# Altium project ALCT_MEZ_LX100.PrjPcb (part 8 of 8)

## Sheet Promless_Power.SchDoc: PROMless Power
size A; Organization: UCLA High Energy Physics; DocumentNumber: 18; Revision: 2.0; SheetNumber: 18; SheetTotal: 23; CurrentDate: 9/6/2018; ModifiedDate: 9/6/2018
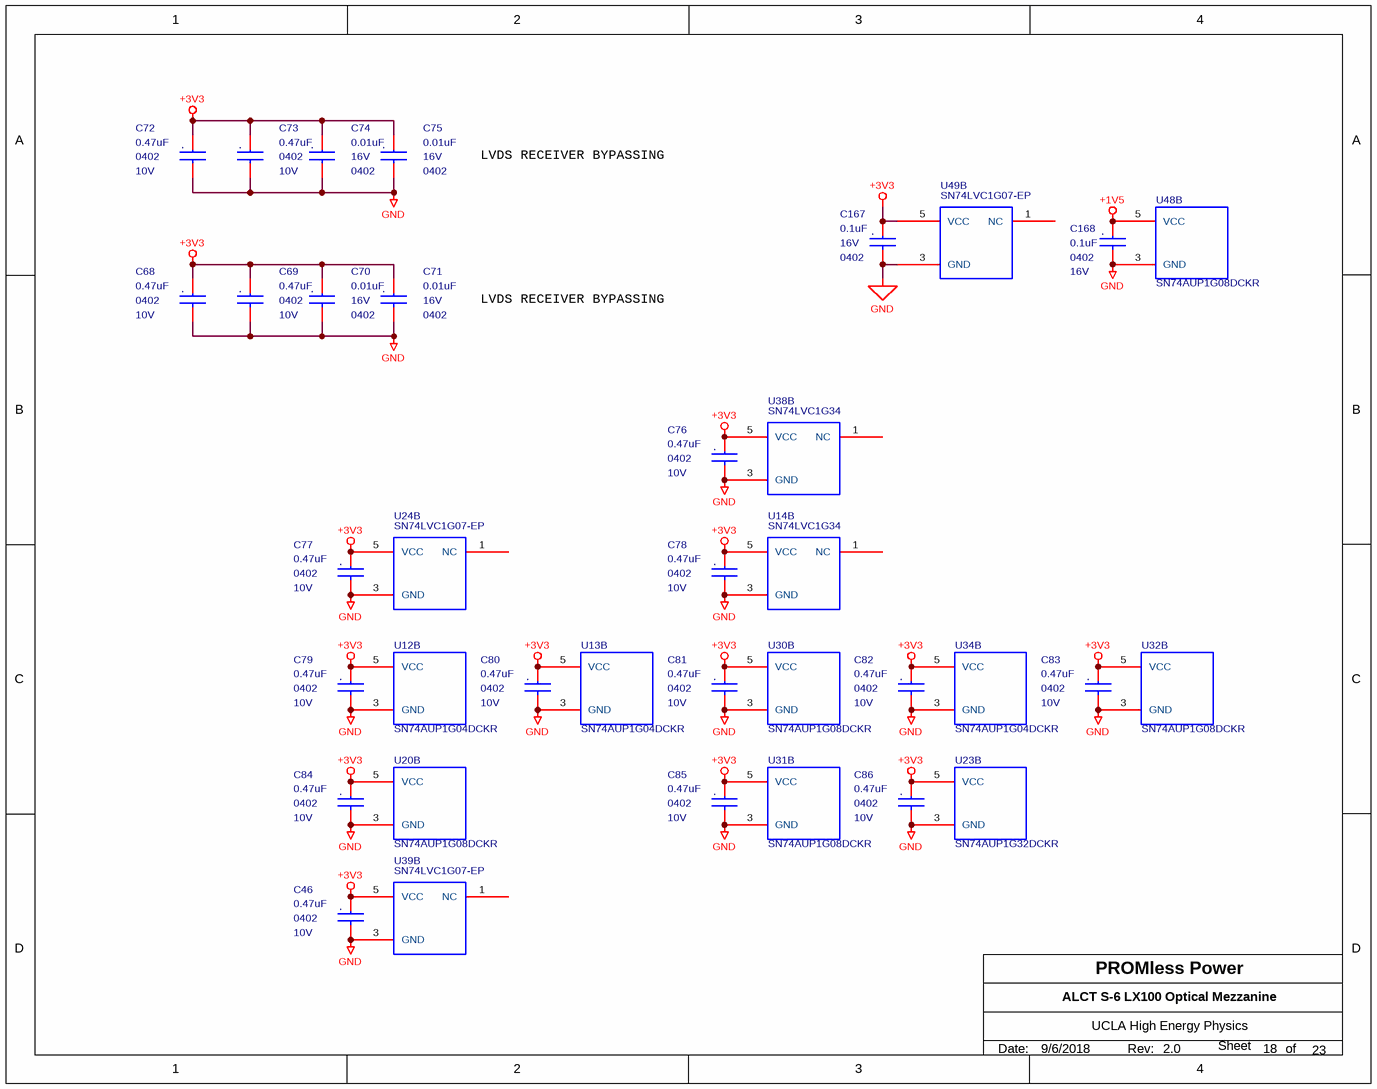
[diagram p25: Promless_Power.SchDoc]

### Parts
C46  0.47uF  Voltage - Rated: 10V  package: 0402  [MC_S6/SM/C_0402_IPC]
C68  0.47uF  Voltage - Rated: 10V  package: 0402  [MC_S6/SM/C_0402_IPC]
C69  0.47uF  Voltage - Rated: 10V  package: 0402  [MC_S6/SM/C_0402_IPC]
C70  0.01uF  Voltage - Rated: 16V  package: 0402  [MC_S6/SM/C_0402_IPC]
C71  0.01uF  Voltage - Rated: 16V  package: 0402  [MC_S6/SM/C_0402_IPC]
C72  0.47uF  Voltage - Rated: 10V  package: 0402  [MC_S6/SM/C_0402_IPC]
C73  0.47uF  Voltage - Rated: 10V  package: 0402  [MC_S6/SM/C_0402_IPC]
C74  0.01uF  Voltage - Rated: 16V  package: 0402  [MC_S6/SM/C_0402_IPC]
C75  0.01uF  Voltage - Rated: 16V  package: 0402  [MC_S6/SM/C_0402_IPC]
C76  0.47uF  Voltage - Rated: 10V  package: 0402  [MC_S6/SM/C_0402_IPC]
C77  0.47uF  Voltage - Rated: 10V  package: 0402  [MC_S6/SM/C_0402_IPC]
C78  0.47uF  Voltage - Rated: 10V  package: 0402  [MC_S6/SM/C_0402_IPC]
C79  0.47uF  Voltage - Rated: 10V  package: 0402  [MC_S6/SM/C_0402_IPC]
C80  0.47uF  Voltage - Rated: 10V  package: 0402  [MC_S6/SM/C_0402_IPC]
C81  0.47uF  Voltage - Rated: 10V  package: 0402  [MC_S6/SM/C_0402_IPC]
C82  0.47uF  Voltage - Rated: 10V  package: 0402  [MC_S6/SM/C_0402_IPC]
C83  0.47uF  Voltage - Rated: 10V  package: 0402  [MC_S6/SM/C_0402_IPC]
C84  0.47uF  Voltage - Rated: 10V  package: 0402  [MC_S6/SM/C_0402_IPC]
C85  0.47uF  Voltage - Rated: 10V  package: 0402  [MC_S6/SM/C_0402_IPC]
C86  0.47uF  Voltage - Rated: 10V  package: 0402  [MC_S6/SM/C_0402_IPC]
C167  0.1uF  package: 0402  Voltage - Rated: 16V  [MC_S6/SM/C_0402_IPC]
C168  0.1uF  package: 0402  Voltage - Rated: 16V  [MC_S6/SM/C_0402_IPC]
U12  SN74AUP1G04DCKR  [MC_S6/SM/SOT_SC70_DCK5]  (part B of 2)
U13  SN74AUP1G04DCKR  [MC_S6/SM/SOT_SC70_DCK5]  (part B of 2)
U14  SN74LVC1G34  [MC_S6/SM/SOT_553_DRL5]  (part B of 2)
U20  SN74AUP1G08DCKR  [MC_S6/SM/SOT_SC70_DCK5]  (part B of 2)
U23  SN74AUP1G32DCKR  [MC_S6/SM/SOT_SC70_DCK5]  (part B of 2)
U24  SN74LVC1G07-EP  [SOT353-1]  (part B of 2)
U30  SN74AUP1G08DCKR  [MC_S6/SM/SOT_SC70_DCK5]  (part B of 2)
U31  SN74AUP1G08DCKR  [MC_S6/SM/SOT_SC70_DCK5]  (part B of 2)
U32  SN74AUP1G08DCKR  [MC_S6/SM/SOT_SC70_DCK5]  (part B of 2)
U34  SN74AUP1G04DCKR  [MC_S6/SM/SOT_SC70_DCK5]  (part B of 2)
U38  SN74LVC1G34  [MC_S6/SM/SOT_553_DRL5]  (part B of 2)
U39  SN74LVC1G07-EP  [SOT353-1]  (part B of 2)
U48  SN74AUP1G08DCKR  [MC_S6/SM/SOT_SC70_DCK5]  (part B of 2)
U49  SN74LVC1G07-EP  [SOT353-1]  (part B of 2)

### Nets
+1V5: C168.1 U48.5(VCC)
+3V3: C46.1 C68.1 C69.1 C70.1 C71.1 C72.1 C73.1 C74.1 C75.1 C76.1 C77.1 C78.1 C79.1 C80.1 C81.1 C82.1 C83.1 C84.1 C85.1 C86.1 C167.1 U12.5(VCC) U13.5(VCC) U14.5(VCC) U20.5(VCC) U23.5(VCC) U24.5(VCC) U30.5(VCC) U31.5(VCC) U32.5(VCC) U34.5(VCC) U38.5(VCC) U39.5(VCC) U49.5(VCC)
GND: C46.2 C68.2 C69.2 C70.2 C71.2 C72.2 C73.2 C74.2 C75.2 C76.2 C77.2 C78.2 C79.2 C80.2 C81.2 C82.2 C83.2 C84.2 C85.2 C86.2 C167.2 C168.2 U12.3(GND) U13.3(GND) U14.3(GND) U20.3(GND) U23.3(GND) U24.3(GND) U30.3(GND) U31.3(GND) U32.3(GND) U34.3(GND) U38.3(GND) U39.3(GND) U48.3(GND) U49.3(GND)

Not connected (* = marked no-connect by the designer): U14 1(NC); U24 1(NC); U38 1(NC); U39 1(NC); U49 1(NC)

### Notes on the sheet
- LVDS RECEIVER BYPASSING
- Date:
- Rev:
- of
- Sheet
- (in symbol C0402C103K4RACTU) .
- (in symbol C0402C104K4RACTU) .
- (in symbol GRM155R61A474KE15D) .

### Library data of the parts
C46 C68 C69 C72 C73 C76-C86 = GRM155R61A474KE15D: CAP CER 0.47UF 10V X5R 0402; Manufacturer: Murata Electronics North America; Capacitance: 0.47µF; Tolerance: ±10%; Supplier 1: Digi-Key; Manufacturer Part Number: GRM155R61A474KE15D; RoHS: RoHS Compliant; Category: Capacitors; Stock 1: 506743; Pricing 1: 1=0.1, 10=0.064, 50=0.0344, 100=0.0292, 250=0.02384, 500=0.0204, 1000=0.0159, 5000=0.01325 (USD); Packaging: Cut Tape (CT); Part Status: Active; Operating Temperature: -55°C ~ 85°C; Features: -; Ratings: -; Applications: General Purpose; Mounting Type: Surface Mount, MLCC; Package / Case: 0402 (1005 Metric); Size / Dimension: 0.039" L x 0.020" W (1.00mm x 0.50mm); Height - Seated (Max): -; Thickness (Max): 0.022" (0.55mm); Lead Spacing: -; Lead Style: -; ComponentLink1URL: http://www.murata.com/~/media/webrenewal/support/library/catalog/products/capacitor/mlcc/c02e.pdf; ComponentLink1Description: http://www.murata.com/~/media/webrenewal/support/library/catalog/products/capacitor/mlcc/c02e.pdf; Supplier 2: Digi-Key; Stock 2: 506743; Pricing 2: 1=0.1, 10=0.064, 50=0.0344, 100=0.0292, 250=0.02384, 500=0.0204, 1000=0.0159, 5000=0.01325 (USD); Supplier Part Number 1: 490-3264-1-ND; Supplier Part Number 2: 490-3264-6-ND; Temperature Coefficient: X5R
C70 C71 C74 C75 = C0402C103K4RACTU: CAP CER 10nF 16V X7R 0402; Manufacturer: KEMET; Capacitance: 10000pF; Tolerance: ±10%; Supplier 1: Digi-Key; Manufacturer Part Number: C0402C103K4RACTU; RoHS: RoHS Compliant; Category: Capacitors; Stock 1: 605739; Pricing 1: 1=0.1, 10=0.02, 25=0.0144, 50=0.0108, 100=0.0088, 250=0.00732, 500=0.00626, 1000=0.00492, 5000=0.00412 (USD); Packaging: Cut Tape (CT); Part Status: Active; Temperature Coefficient: X7R; Operating Temperature: -55°C ~ 125°C; Features: -; Ratings: -; Applications: General Purpose; Failure Rate: -; Mounting Type: Surface Mount, MLCC; Package / Case: 0402 (1005 Metric); Size / Dimension: 0.039" L x 0.020" W (1.00mm x 0.50mm); Height - Seated (Max): -; Thickness (Max): 0.022" (0.55mm); Lead Spacing: -; Lead Style: -; ComponentLink1URL: http://www.kemet.com/docfinder?Partnumber=C0402C103K4RACTU; ComponentLink1Description: http://www.kemet.com/docfinder?Partnumber=C0402C103K4RACTU; Supplier 2: Digi-Key; Stock 2: 605739; Pricing 2: 1=0.1, 10=0.02, 25=0.0144, 50=0.0108, 100=0.0088, 250=0.00732, 500=0.00626, 1000=0.00492, 5000=0.00412 (USD); Supplier Part Number 1: 399-1038-1-ND; Supplier Part Number 2: 399-1038-6-ND
C167 C168 = C0402C104K4RACTU: CAP CER 0.1UF 16V X7R 0402; Manufacturer: KEMET; Capacitance: 0.10µF; Tolerance: ±10%; Supplier 1: Digi-Key; Manufacturer Part Number: C0402C104K4RACTU; RoHS: RoHS Compliant; Category: Capacitors; Stock 1: 3565698; Pricing 1: 1=0.11, 10=0.078, 25=0.0568, 50=0.0442, 100=0.0365, 250=0.03024, 500=0.02562, 1000=0.02121, 5000=0.01806 (USD); Packaging: Cut Tape (CT); Part Status: Active; Operating Temperature: -55°C ~ 125°C; Features: -; Ratings: -; Applications: General Purpose; Failure Rate: -; Mounting Type: Surface Mount, MLCC; Package / Case: 0402 (1005 Metric); Size / Dimension: 0.039" L x 0.020" W (1.00mm x 0.50mm); Height - Seated (Max): -; Thickness (Max): 0.022" (0.55mm); Lead Spacing: -; Lead Style: -; ComponentLink1URL: http://www.kemet.com/docfinder?Partnumber=C0402C104K4RACTU; ComponentLink1Description: http://www.kemet.com/docfinder?Partnumber=C0402C104K4RACTU; Supplier 2: Digi-Key; Stock 2: 3565998; Pricing 2: 1=0.11, 10=0.078, 25=0.0568, 50=0.0442, 100=0.0365, 250=0.03024, 500=0.02562, 1000=0.02121, 5000=0.01806 (USD); Supplier Part Number 1: 399-3521-1-ND; Supplier Part Number 2: 399-3521-6-ND; Temperature Coefficient: X7R
U12 U13 U34 = SN74AUP1G04DCKR: IC INVERTER LP 5TSSOP; Manufacturer: Texas Instruments; Number of Inputs: 1; Voltage - Supply: 0.8 V ~ 3.6 V; Current - Output High, Low: 4mA, 4mA; Logic Level - Low: 0.7 V ~ 0.9 V; Logic Level - High: 1.6 V ~ 2 V; Max Propagation Delay @ V, Max CL: 5.4ns @ 3.3V, 30pF; Supplier 1: Digi-Key; Manufacturer Part Number: SN74AUP1G04DCKR; RoHS: RoHS Compliant; Category: Integrated Circuits (ICs); Stock 1: 7270; Pricing 1: 1=0.48, 10=0.364, 100=0.227, 500=0.15532, 1000=0.11948 (USD); Packaging: Digi-Reel®; Part Status: Active; Logic Type: Inverter; Features: -; Operating Temperature: -40°C ~ 85°C; Mounting Type: Surface Mount; Supplier Device Package: SC-70-5; Package / Case: 5-TSSOP, SC-70-5, SOT-353; ComponentLink1URL: http://www.ti.com/lit/ds/symlink/sn74aup1g04.pdf; ComponentLink1Description: http://www.ti.com/lit/ds/symlink/sn74aup1g04.pdf; Supplier 2: Digi-Key; Stock 2: 7270; Pricing 2: 1=0.48, 10=0.364, 100=0.227, 500=0.15532, 1000=0.11948 (USD); Supplier Part Number 1: 296-19072-6-ND; Supplier Part Number 2: 296-19072-1-ND
U14 U38 = SN74LVC1G34DRLR: IC BUFFER NON-INVERT SOT5; Manufacturer: Texas Instruments; mfgr: Texas Inst; mfgr_foot: DRL; COMPROT: 270; COMPGROUP: 0; COMPSIDE: TOP; Logic Type: Buffer, Non-Inverting; Number of Bits per Element: 1; Output Type: Push-Pull; Current - Output High, Low: 32mA, 32mA; Voltage - Supply: 1.65 V ~ 5.5 V; mfgr_id: SN74LVC1G34DRLR; Package: 99; Supplier 1: Digi-Key; Manufacturer Part Number: SN74LVC1G34DRLR; RoHS: RoHS Compliant; Category: Integrated Circuits (ICs); Stock 1: 1633; Pricing 1: 1=0.48, 10=0.387, 100=0.2637, 500=0.19776, 1000=0.14832 (USD); Packaging: Cut Tape (CT); Part Status: Active; Input Type: -; Operating Temperature: -40°C ~ 125°C (TA); Mounting Type: Surface Mount; Package / Case: SOT-553; Supplier Device Package: SOT-5; ComponentLink1URL: http://www.ti.com/lit/ds/symlink/sn74lvc1g34.pdf; ComponentLink1Description: http://www.ti.com/lit/ds/symlink/sn74lvc1g34.pdf; Supplier 2: Digi-Key; Stock 2: 1633; Pricing 2: 1=0.48, 10=0.387, 100=0.2637, 500=0.19776, 1000=0.14832 (USD); Supplier Part Number 1: 296-18017-1-ND; Supplier Part Number 2: 296-18017-6-ND
U20 U30-U32 U48 = SN74AUP1G08DCKR: IC GATE AND 1CH 2-INP 5-TSSOP; Manufacturer: Texas Instruments; Manufacturer Part Number: SN74AUP1G08DCKT; Logic Type: AND Gate; Number of Inputs: 2; Voltage - Supply: 0.8 V ~ 3.6 V; Current - Output High, Low: 4mA, 4mA; Logic Level - Low: 0.7 V ~ 0.9 V; Logic Level - High: 1.6 V ~ 2 V; Max Propagation Delay @ V, Max CL: 6.2ns @ 3.3V, 30pF; Supplier 1: Digi-Key; RoHS: RoHS Compliant; Category: Integrated Circuits (ICs); Stock 1: 7470; Pricing 1: 1=0.8, 10=0.707, 100=0.542 (USD); Packaging: Cut Tape (CT); Part Status: Active; Features: -; Operating Temperature: -40°C ~ 85°C; Mounting Type: Surface Mount; Supplier Device Package: SC-70-5; Package / Case: 5-TSSOP, SC-70-5, SOT-353; ComponentLink1URL: http://www.ti.com/lit/ds/symlink/sn74aup1g08.pdf; ComponentLink1Description: http://www.ti.com/lit/ds/symlink/sn74aup1g08.pdf; Supplier 2: Digi-Key; Stock 2: 7470; Pricing 2: 1=0.8, 10=0.707, 100=0.542 (USD); Supplier Part Number 1: 296-32258-1-ND; Supplier Part Number 2: 296-32258-6-ND
U23 = SN74AUP1G32DCKR: IC GATE OR 1CH 2-INP 5-TSSOP; Manufacturer: Texas Instruments; Manufacturer Part Number: SN74AUP1G32DCKT; Logic Type: OR Gate; Number of Inputs: 2; Voltage - Supply: 0.8 V ~ 3.6 V; Current - Output High, Low: 4mA, 4mA; Logic Level - Low: 0.7 V ~ 0.9 V; Logic Level - High: 1.6 V ~ 2 V; Max Propagation Delay @ V, Max CL: 6.4ns @ 3.3V, 30pF; Supplier 1: Digi-Key; RoHS: RoHS Compliant; Category: Integrated Circuits (ICs); Stock 1: 96; Pricing 1: 1=0.8, 10=0.707, 100=0.542 (USD); Packaging: Cut Tape (CT); Part Status: Active; Features: -; Operating Temperature: -40°C ~ 85°C; Mounting Type: Surface Mount; Supplier Device Package: SC-70-5; Package / Case: 5-TSSOP, SC-70-5, SOT-353; ComponentLink1URL: http://www.ti.com/lit/ds/symlink/sn74aup1g32.pdf; ComponentLink1Description: http://www.ti.com/lit/ds/symlink/sn74aup1g32.pdf; Supplier 2: Digi-Key; Stock 2: 96; Pricing 2: 1=0.8, 10=0.707, 100=0.542 (USD); Supplier Part Number 1: 296-32262-1-ND; Supplier Part Number 2: 296-32262-6-ND
U24 U39 U49 = SN74LVC1G07-EP: IC BUFF/DVR NON-INVERT Open Drain SC70-5; Manufacturer: Texas Instruments; mfgr_id: SN74LVC1G07MDCKREP; mfgr: Texas Inst; mfgr_foot: DCK; COMPROT: 270; COMPGROUP: 0; COMPSIDE: TOP; Logic Type: Buffer, Non-Inverting; Number of Bits per Element: 1; Current - Output High, Low: -, 32mA; Voltage - Supply: 1.65 V ~ 5.5 V; Package: 99; Supplier 1: Digi-Key; Manufacturer Part Number: SN74LVC1G07MDCKREP; RoHS: RoHS Compliant; Category: Integrated Circuits (ICs); Stock 1: 4252; Pricing 1: 1=0.81, 10=0.714, 100=0.5472, 500=0.4326, 1000=0.34608 (USD); Packaging: Cut Tape (CT); Part Status: Active; Input Type: -; Output Type: Open Drain; Operating Temperature: -55°C ~ 125°C (TA); Mounting Type: Surface Mount; Package / Case: 5-TSSOP, SC-70-5, SOT-353; Supplier Device Package: SC-70-5; ComponentLink1URL: http://www.ti.com/lit/ds/symlink/sn74lvc1g07-ep.pdf; ComponentLink1Description: http://www.ti.com/lit/ds/symlink/sn74lvc1g07-ep.pdf; Supplier 2: Digi-Key; Stock 2: 4252; Pricing 2: 1=0.81, 10=0.714, 100=0.5472, 500=0.4326, 1000=0.34608 (USD); Supplier Part Number 1: 296-22343-1-ND; Supplier Part Number 2: 296-22343-6-ND

## Nets that join several sheets
+1V2: FPGA_Power (35 pins), Power (5 pins), ADC (C17.1 U15.5)
+1V5: Power (5 pins), ADC (C19.1 U15.7), GBTx_IO (R52.1 R61.1), GBTx_Control (15 pins), GBTx_MGT (7 pins), GBTx_Power (51 pins), Promless_Power (C168.1 U48.5)
+1V5A: Power (5 pins), ADC (C163.1 U15.8), GBTx_Power (C170.1 L4.2 R129.1)
+1V8: Power (5 pins), ADC (C16.1 U15.4), EEPROM (7 pins)
+2V5: FPGA_Power (32 pins), Power (5 pins), ADC (R14.1), FPGA_Configuration (U26.6 U27.6 U28.6), EEPROM (5 pins)
+2V5_SFP: Power (13 pins), ADC (R107.1), GBTx_MGT (7 pins)
+3V3: XP1 (8 pins), XP2 (8 pins), XP3 (8 pins), XP4 (8 pins), FPGA_Power (101 pins), FPGA_IO (R91.1 R98.1 U43.5), Power (21 pins), ADC (11 pins), DSN (C67.1 R89.1), Config_Clock (12 pins), Source_Select (16 pins), GBTx_IO (9 pins), FPGA_Configuration (22 pins), EEPROM (10 pins), GBTx_Control (R130.2 U42.6), GBTx_MGT (5 pins), Promless_Power (34 pins)
+Vcore: XP1 (8 pins), XP2 (8 pins), XP3 (8 pins), XP4 (8 pins), Power (11 pins), ADC (C15.1 U15.3)
GND: XP1 (20 pins), XP2 (43 pins), XP3 (18 pins), XP4 (20 pins), FPGA_Power (72 pins), FPGA_IO (D9.K R92.2 U43.3), FPGA_Ground (71 pins), Power (51 pins), ADC (25 pins), Mechanical (14 pins), DSN (C67.2 U11.1 U11.4), Config_Clock (11 pins), Source_Select (18 pins), GBTx_IO (12 pins), FPGA_Configuration (20 pins), EEPROM (23 pins), GBTx_Control (17 pins), GBTx_MGT (33 pins), GBTx_Power (98 pins), Promless_Power (36 pins)
/PROGR: XP2 (XP2.D34), GBTx_IO (U24.4), FPGA_Configuration (PROGB.1 R30.2 R31.2 U1.AF3), EEPROM (U2.6)
adc_eoc: FPGA_IO (U1.A20), ADC (U15.19)
adc_ncs: FPGA_IO (U1.B22), ADC (U15.15)
adc_sck: FPGA_IO (U1.A21), ADC (U15.18)
adc_sdi: FPGA_IO (U1.C21), ADC (U15.17)
adc_sdo: FPGA_IO (U1.A22), ADC (U15.16)
CCLK: Config_Clock (U38.4), FPGA_Configuration (CCLK.1 R34.2 R90.1 U1.AD22), EEPROM (U2.12)
D0: GBTx_IO (TD0.1 U44.15), FPGA_Configuration (U1.AD20), EEPROM (U2.28)
D1: GBTx_IO (TD1.1 U44.14), FPGA_Configuration (U1.AE17), EEPROM (U2.29)
D2: GBTx_IO (TD2.1 U44.11), FPGA_Configuration (U1.AF17), EEPROM (U2.32)
D3: GBTx_IO (TD3.1 U44.10), FPGA_Configuration (U1.AD10), EEPROM (U2.33)
D4: GBTx_IO (TD4.1 U45.15), FPGA_Configuration (U1.AF10), EEPROM (U2.43)
D5: GBTx_IO (TD5.1 U45.14), FPGA_Configuration (U1.AE7), EEPROM (U2.44)
D6: GBTx_IO (TD6.1 U45.11), FPGA_Configuration (U1.AF7), EEPROM (U2.47)
D7: GBTx_IO (TD7.1 U45.10), FPGA_Configuration (U1.AE9), EEPROM (U2.48)
DONE: FPGA_Configuration (DONE.1 R32.2 U1.AF23 U41.2), EEPROM (U2.13), GBTx_MGT (U31.2)
elink0_n: FPGA_IO (U1.AA19), GBTx_IO (U25.U5)
elink0_p: FPGA_IO (U1.Y18), GBTx_IO (U25.U6)
elink1_n: FPGA_IO (U1.AF18), GBTx_IO (U25.T12)
elink1_p: FPGA_IO (U1.AD18), GBTx_IO (U25.T11)
elink2_n: FPGA_IO (U1.AD17), GBTx_IO (U25.D10)
elink2_p: FPGA_IO (U1.AC16), GBTx_IO (U25.D9)
elink3_n: FPGA_IO (U1.AF15), GBTx_IO (U25.F8)
elink3_p: FPGA_IO (U1.AE15), GBTx_IO (U25.F7)
elink4_n: FPGA_IO (U1.AD19), GBTx_IO (U25.G18)
elink4_p: FPGA_IO (U1.AC19), GBTx_IO (U25.F18)
elink5_n: FPGA_IO (U1.AF19), GBTx_IO (U25.E11)
elink5_p: FPGA_IO (U1.AE19), GBTx_IO (U25.E12)
elink6_n: FPGA_IO (U1.W16), GBTx_IO (U25.R17)
elink6_p: FPGA_IO (U1.V15), GBTx_IO (U25.P17)
elink7_n: FPGA_IO (U1.AA17), GBTx_IO (U25.K15)
elink7_p: FPGA_IO (U1.Y16), GBTx_IO (U25.L15)
elink8_n: FPGA_IO (U1.AD15), GBTx_IO (U25.U16)
elink8_p: FPGA_IO (U1.AC15), GBTx_IO (U25.U15)
elink9_n: FPGA_IO (U1.AF21), GBTx_IO (U25.D14)
elink9_p: FPGA_IO (U1.AE21), GBTx_IO (U25.D13)
elink10_n: FPGA_IO (U1.AB18), GBTx_IO (U25.T4)
elink10_p: FPGA_IO (U1.AA18), GBTx_IO (U25.U4)
elink11_n: FPGA_IO (U1.W17), GBTx_IO (U25.W7)
elink11_p: FPGA_IO (U1.V16), GBTx_IO (U25.V7)
elink12_n: FPGA_IO (U1.AD21), GBTx_IO (U25.A16)
elink12_p: FPGA_IO (U1.AC20), GBTx_IO (U25.A15)
elink13_n: FPGA_IO (U1.AC17), GBTx_IO (U25.A8)
elink13_p: FPGA_IO (U1.AB17), GBTx_IO (U25.A7)
en_2v5_sfp_xfpga: FPGA_IO (U1.W8), Power (U22.2)
gbt_clk40_n: FPGA_IO (U1.AF14), GBTx_IO (U25.V15)
gbt_clk40_p: FPGA_IO (U1.AD14), GBTx_IO (U25.V16)
gbt_clk320_n: FPGA_IO (U1.AF13), GBTx_IO (U25.R7)
gbt_clk320_p: FPGA_IO (U1.AE13), GBTx_IO (U25.R8)
gbt_dskw_cclk: Config_Clock (R62.1), GBTx_IO (R54.2 U46.14)
gbt_dskw_cclk_n: GBTx_IO (R121.2 U46.4), GBTx_Control (U25.J4)
gbt_dskw_cclk_p: GBTx_IO (R121.1 U46.3), GBTx_Control (U25.H4)
gbt_eprt_cclk: Config_Clock (R63.1), GBTx_IO (R55.2 U46.15)
gbt_ld_reset: GBTx_Control (R72.2 R93.2), GBTx_MGT (J1.3)
gbt_ld_scl: GBTx_Control (R70.2 U25.K8), GBTx_MGT (J1.5)
gbt_ld_sda: GBTx_Control (R71.2 U25.H8), GBTx_MGT (J1.4)
gbt_override: Source_Select (U34.2 U36.15), GBTx_IO (R58.2 U47.11)
gbt_~{reset}_ex: FPGA_IO (U1.U8), GBTx_Control (R130.1 U49.2)
gbt_rx_rssi: ADC (C18.1 U15.6), GBTx_MGT (J1.8 R25.1)
gbt_rxrdy_dav: GBTx_IO (U20.2 U46.16 U47.16), GBTx_MGT (R96.2 RXRDY_DAV.1 U30.4)
gbt_sel_dskw_~{eprt}_clk: Source_Select (U33.5), GBTx_IO (R59.2 U47.15)
gbt_sel_gbt_~{xprm}: Source_Select (U33.2), GBTx_IO (R60.2 U47.14)
gbt_tx_datavalid: FPGA_IO (U1.M24), GBTx_MGT (R28.1 U31.1)
gbt_txrdy: FPGA_IO (U1.K21), GBTx_MGT (U40.7)
gbt_widebus: FPGA_IO (U39.4), GBTx_Control (R99.1)
INIT_B: Source_Select (U32.2), FPGA_Configuration (INIT.1 R33.2 U1.AE4 U41.3)
led1: XP2 (XP2.A25), FPGA_IO (U1.A18)
led2: XP2 (XP2.A26), FPGA_IO (U1.A19)
led3: XP2 (XP2.A27), FPGA_IO (U1.D20)
led4: XP2 (XP2.A28), FPGA_IO (U1.G17)
led5: XP2 (XP2.B25), FPGA_IO (U1.C18)
led6: XP2 (XP2.B26), FPGA_IO (U1.D18)
led7: XP2 (XP2.B27), FPGA_IO (U1.D19)
led8: XP2 (XP2.B28), FPGA_IO (U1.F16)
led9: XP2 (XP2.B29), FPGA_IO (U1.E17)
led10: XP2 (XP2.B30), FPGA_IO (U1.E18)
led11: XP2 (XP2.C25), FPGA_IO (U1.E14)
led12: XP2 (XP2.C26), FPGA_IO (U1.F15)
led13: XP2 (XP2.C27), FPGA_IO (U1.F17)
led14: XP2 (XP2.C28), FPGA_IO (U1.E16)
led15: XP2 (XP2.C29), FPGA_IO (U1.C20)
led16: XP2 (XP2.D25), FPGA_IO (U1.B18)
led17: XP2 (XP2.D26), FPGA_IO (U1.C19)
led18: XP2 (XP2.D27), FPGA_IO (U1.H17)
led19: XP2 (XP2.D28), FPGA_IO (U1.H18)
led20: XP2 (XP2.D29), FPGA_IO (U1.F18)
mc_sn: FPGA_IO (U1.B14), DSN (DSN.1 R89.2 U11.2)
mez_clock: XP2 (XP2.D21), FPGA_IO (R91.2 R92.1 U1.A14), Config_Clock (TTCCLK.1 U14.2)
PROM_OE: Source_Select (U32.4), EEPROM (U2.11)
sel_dskw_~{eprt}_clk: Config_Clock (U10.4 U12.2), Source_Select (SEL_DSKW.1 U33.6 U36.9)
sel_~{gbt}_xprm: Config_Clock (U10.10), Source_Select (U13.4 U32.1)
sel_gbt_~{xprm}: Config_Clock (U10.13), Source_Select (SEL_GBT.1 U13.2 U33.3 U36.4), GBTx_IO (U20.1)
TCK_2V5: FPGA_Configuration (C47.1 U1.E21 U27.4), EEPROM (U2.20)
TCK_Pr: XP2 (XP2.D7), Source_Select (C60.1 U35.8), FPGA_Configuration (TCK.1 U27.3)
TDI_Pr: XP2 (XP2.C8), FPGA_Configuration (TDI.1 U26.3)
TDO_FPGA: FPGA_Configuration (TDOF.1 U1.A24), EEPROM (U2.19)
TDO_Pr: XP2 (XP2.D8), Source_Select (R97.1 U35.14)
TDO_PROM: Source_Select (R97.2 U35.13), EEPROM (TDOP.1 U37.4)
TMS_2V5: FPGA_Configuration (U1.C23 U28.4), EEPROM (U2.21)
TMS_Pr: XP2 (XP2.C7), Source_Select (U35.9), FPGA_Configuration (TMS.1 U28.3)
XP1A_3: XP1 (XP1.A3), FPGA_IO (U1.E4)
XP1A_4: XP1 (XP1.A4), FPGA_IO (U1.F5)
XP1A_5: XP1 (XP1.A5), FPGA_IO (U1.G4)
XP1A_6: XP1 (XP1.A6), FPGA_IO (U1.H5)
XP1A_7: XP1 (XP1.A7), FPGA_IO (U1.J3)
XP1A_8: XP1 (XP1.A8), FPGA_IO (U1.K1)
XP1A_22: XP1 (XP1.A22), FPGA_IO (U1.K3)
XP1A_23: XP1 (XP1.A23), FPGA_IO (U1.U4)
XP1A_29: XP1 (XP1.A29), FPGA_IO (U1.J4)
XP1A_30: XP1 (XP1.A30), FPGA_IO (U1.K5)
XP1A_31: XP1 (XP1.A31), FPGA_IO (U1.L3)
XP1A_32: XP1 (XP1.A32), FPGA_IO (U1.N5)
XP1A_33: XP1 (XP1.A33), FPGA_IO (U1.N6)
XP1A_34: XP1 (XP1.A34), FPGA_IO (U1.N7)
XP1A_35: XP1 (XP1.A35), FPGA_IO (U1.N8)
XP1A_36: XP1 (XP1.A36), FPGA_IO (U1.P7)
XP1A_37: XP1 (XP1.A37), FPGA_IO (U1.R5)
XP1A_38: XP1 (XP1.A38), FPGA_IO (U1.W3)
XP1B_3: XP1 (XP1.B3), FPGA_IO (U1.G3)
XP1B_4: XP1 (XP1.B4), FPGA_IO (U1.H3)
XP1B_5: XP1 (XP1.B5), FPGA_IO (U1.J5)
XP1B_6: XP1 (XP1.B6), FPGA_IO (U1.J1)
XP1B_7: XP1 (XP1.B7), FPGA_IO (U1.J2)
XP1B_8: XP1 (XP1.B8), FPGA_IO (U1.H1)
XP1B_22: XP1 (XP1.B22), FPGA_IO (U1.M3)
XP1B_23: XP1 (XP1.B23), FPGA_IO (U1.N3)
XP1B_29: XP1 (XP1.B29), FPGA_IO (U1.L2)
XP1B_30: XP1 (XP1.B30), FPGA_IO (U1.M4)
XP1B_31: XP1 (XP1.B31), FPGA_IO (U1.N4)
XP1B_32: XP1 (XP1.B32), FPGA_IO (U1.P6)
XP1B_33: XP1 (XP1.B33), FPGA_IO (U1.R4)
XP1B_34: XP1 (XP1.B34), FPGA_IO (U1.T4)
XP1B_35: XP1 (XP1.B35), FPGA_IO (U1.T6)
XP1B_36: XP1 (XP1.B36), FPGA_IO (U1.U3)
XP1B_37: XP1 (XP1.B37), FPGA_IO (U1.V4)
XP1B_38: XP1 (XP1.B38), FPGA_IO (U1.AA3)
XP1C_3: XP1 (XP1.C3), FPGA_IO (U1.C2)
XP1C_4: XP1 (XP1.C4), FPGA_IO (U1.D3)
XP1C_5: XP1 (XP1.C5), FPGA_IO (U1.E2)
XP1C_6: XP1 (XP1.C6), FPGA_IO (U1.E3)
XP1C_7: XP1 (XP1.C7), FPGA_IO (U1.F3)
XP1C_8: XP1 (XP1.C8), FPGA_IO (U1.G2)
XP1C_29: XP1 (XP1.C29), FPGA_IO (U1.P5)
XP1C_30: XP1 (XP1.C30), FPGA_IO (U1.P3)
XP1C_31: XP1 (XP1.C31), FPGA_IO (U1.P1)
XP1C_32: XP1 (XP1.C32), FPGA_IO (U1.R2)
XP1C_33: XP1 (XP1.C33), FPGA_IO (U1.R3)
XP1C_34: XP1 (XP1.C34), FPGA_IO (U1.T3)
XP1C_35: XP1 (XP1.C35), FPGA_IO (U1.U2)
XP1C_36: XP1 (XP1.C36), FPGA_IO (U1.V3)
XP1C_37: XP1 (XP1.C37), FPGA_IO (U1.W2)
XP1C_38: XP1 (XP1.C38), FPGA_IO (U1.AA2)
XP1D_3: XP1 (XP1.D3), FPGA_IO (U1.B1)
XP1D_4: XP1 (XP1.D4), FPGA_IO (U1.C1)
XP1D_5: XP1 (XP1.D5), FPGA_IO (U1.D1)
XP1D_6: XP1 (XP1.D6), FPGA_IO (U1.E1)
XP1D_7: XP1 (XP1.D7), FPGA_IO (U1.F1)
XP1D_8: XP1 (XP1.D8), FPGA_IO (U1.G1)
XP1D_29: XP1 (XP1.D29), FPGA_IO (U1.L1)
XP1D_30: XP1 (XP1.D30), FPGA_IO (U1.M1)
XP1D_31: XP1 (XP1.D31), FPGA_IO (U1.N1)
XP1D_32: XP1 (XP1.D32), FPGA_IO (U1.R1)
XP1D_33: XP1 (XP1.D33), FPGA_IO (U1.T1)
XP1D_34: XP1 (XP1.D34), FPGA_IO (U1.U1)
XP1D_35: XP1 (XP1.D35), FPGA_IO (U1.V1)
XP1D_36: XP1 (XP1.D36), FPGA_IO (U1.W1)
XP1D_37: XP1 (XP1.D37), FPGA_IO (U1.Y1)
XP1D_38: XP1 (XP1.D38), FPGA_IO (U1.AA1)
XP2A_3: XP2 (XP2.A3), FPGA_IO (U1.A2)
XP2A_4: XP2 (XP2.A4), FPGA_IO (U1.A4)
XP2A_10: XP2 (XP2.A10), FPGA_IO (U1.A5)
XP2A_11: XP2 (XP2.A11), FPGA_IO (U1.A6)
XP2A_12: XP2 (XP2.A12), FPGA_IO (U1.A7)
XP2A_13: XP2 (XP2.A13), FPGA_IO (U1.A8)
XP2A_14: XP2 (XP2.A14), FPGA_IO (U1.A9)
XP2A_15: XP2 (XP2.A15), FPGA_IO (U1.A10)
XP2A_16: XP2 (XP2.A16), FPGA_IO (U1.A11)
XP2A_17: XP2 (XP2.A17), FPGA_IO (U1.A12)
XP2A_18: XP2 (XP2.A18), FPGA_IO (U1.A13)
XP2A_19: XP2 (XP2.A19), FPGA_IO (U1.F10)
XP2A_22: XP2 (XP2.A22), FPGA_IO (U1.A15)
XP2A_23: XP2 (XP2.A23), FPGA_IO (U1.A16)
XP2A_24: XP2 (XP2.A24), FPGA_IO (U1.A17)
XP2A_29: XP2 (XP2.A29), FPGA_IO (U1.B20)
XP2A_37: XP2 (XP2.A37), FPGA_IO (U1.A25)
XP2A_38: XP2 (XP2.A38), FPGA_IO (U1.B25)
XP2B_3: XP2 (XP2.B3), FPGA_IO (U1.B2)
XP2B_4: XP2 (XP2.B4), FPGA_IO (U1.B4)
XP2B_10: XP2 (XP2.B10), FPGA_IO (U1.C4)
XP2B_11: XP2 (XP2.B11), FPGA_IO (U1.C5)
XP2B_12: XP2 (XP2.B12), FPGA_IO (U1.B6)
XP2B_13: XP2 (XP2.B13), FPGA_IO (U1.C7)
XP2B_14: XP2 (XP2.B14), FPGA_IO (U1.B8)
XP2B_15: XP2 (XP2.B15), FPGA_IO (U1.C9)
XP2B_16: XP2 (XP2.B16), FPGA_IO (U1.B10)
XP2B_17: XP2 (XP2.B17), FPGA_IO (U1.C11)
XP2B_18: XP2 (XP2.B18), FPGA_IO (U1.B12)
XP2B_19: XP2 (XP2.B19), FPGA_IO (U1.C13)
XP2B_22: XP2 (XP2.B22), FPGA_IO (U1.G14)
XP2B_23: XP2 (XP2.B23), FPGA_IO (U1.D16)
XP2B_24: XP2 (XP2.B24), FPGA_IO (U1.C16)
XP2B_37: XP2 (XP2.B37), FPGA_IO (U1.B23)
XP2B_38: XP2 (XP2.B38), FPGA_IO (U1.A23)
XP2C_3: XP2 (XP2.C3), FPGA_IO (U1.C3)
XP2C_4: XP2 (XP2.C4), FPGA_IO (U1.C6)
XP2C_10: XP2 (XP2.C10), FPGA_IO (U1.D7)
XP2C_11: XP2 (XP2.C11), FPGA_IO (U1.C8)
XP2C_12: XP2 (XP2.C12), FPGA_IO (U1.D10)
XP2C_13: XP2 (XP2.C13), FPGA_IO (U1.C10)
XP2C_14: XP2 (XP2.C14), FPGA_IO (U1.D11)
XP2C_15: XP2 (XP2.C15), FPGA_IO (U1.C12)
XP2C_16: XP2 (XP2.C16), FPGA_IO (U1.F13)
XP2C_17: XP2 (XP2.C17), FPGA_IO (U1.D14)
XP2C_18: XP2 (XP2.C18), FPGA_IO (U1.C14)
XP2C_19: XP2 (XP2.C19), FPGA_IO (U1.D13)
XP2C_22: XP2 (XP2.C22), FPGA_IO (U1.C15)
XP2C_23: XP2 (XP2.C23), FPGA_IO (U1.J15)
XP2C_24: XP2 (XP2.C24), FPGA_IO (U1.H15)
XP2C_30: XP2 (XP2.C30), FPGA_IO (U1.E20)
XP2C_37: XP2 (XP2.C37), FPGA_IO (U1.E19)
XP2C_38: XP2 (XP2.C38), FPGA_IO (U1.D23)
XP2D_3: XP2 (XP2.D3), FPGA_IO (U1.E5)
XP2D_4: XP2 (XP2.D4), FPGA_IO (U1.D5)
XP2D_10: XP2 (XP2.D10), FPGA_IO (U1.E6)
XP2D_11: XP2 (XP2.D11), FPGA_IO (U1.D6)
XP2D_12: XP2 (XP2.D12), FPGA_IO (U1.D8)
XP2D_13: XP2 (XP2.D13), FPGA_IO (U1.E8)
XP2D_14: XP2 (XP2.D14), FPGA_IO (U1.E9)
XP2D_15: XP2 (XP2.D15), FPGA_IO (U1.E10)
XP2D_16: XP2 (XP2.D16), FPGA_IO (U1.F11)
XP2D_17: XP2 (XP2.D17), FPGA_IO (U1.D12)
XP2D_18: XP2 (XP2.D18), FPGA_IO (U1.D15)
XP2D_23: XP2 (XP2.D23), FPGA_IO (U1.B16)
XP2D_24: XP2 (XP2.D24), FPGA_IO (U1.C17)
XP2D_37: XP2 (XP2.D37), FPGA_IO (U1.D21)
XP2D_38: XP2 (XP2.D38), FPGA_IO (U1.B24)
XP3A_3: XP3 (XP3.A3), FPGA_IO (U1.V10)
XP3A_4: XP3 (XP3.A4), FPGA_IO (U1.U9)
XP3A_5: XP3 (XP3.A5), FPGA_IO (U1.V5)
XP3A_6: XP3 (XP3.A6), FPGA_IO (U1.W7)
XP3A_7: XP3 (XP3.A7), FPGA_IO (U1.Y6)
XP3A_8: XP3 (XP3.A8), FPGA_IO (U1.AA5)
XP3A_9: XP3 (XP3.A9), FPGA_IO (U1.AA8)
XP3A_10: XP3 (XP3.A10), FPGA_IO (U1.Y9)
XP3A_11: XP3 (XP3.A11), FPGA_IO (U1.Y10)
XP3A_12: XP3 (XP3.A12), FPGA_IO (U1.Y5)
XP3A_13: XP3 (XP3.A13), FPGA_IO (U1.AD5)
XP3A_14: XP3 (XP3.A14), FPGA_IO (U1.W12)
XP3A_15: XP3 (XP3.A15), FPGA_IO (U1.AB11)
XP3A_16: XP3 (XP3.A16), FPGA_IO (U1.AC9)
XP3A_17: XP3 (XP3.A17), FPGA_IO (U1.Y13)
XP3A_18: XP3 (XP3.A18), FPGA_IO (U1.AC11)
XP3A_20: XP3 (XP3.A20), FPGA_IO (U1.AB13)
XP3A_21: XP3 (XP3.A21), FPGA_IO (U1.AA13)
XP3A_23: XP3 (XP3.A23), FPGA_IO (U1.Y14)
XP3A_24: XP3 (XP3.A24), FPGA_IO (U1.AC14)
XP3A_25: XP3 (XP3.A25), FPGA_IO (U1.T10)
XP3A_26: XP3 (XP3.A26), FPGA_IO (U1.V8)
XP3A_27: XP3 (XP3.A27), FPGA_IO (U1.U23)
XP3A_28: XP3 (XP3.A28), FPGA_IO (U1.AC13)
XP3A_29: XP3 (XP3.A29), FPGA_IO (U1.P17)
XP3A_30: XP3 (XP3.A30), FPGA_IO (U1.P18)
XP3A_31: XP3 (XP3.A31), FPGA_IO (U1.Y8)
XP3A_32: XP3 (XP3.A32), FPGA_IO (U1.W9)
XP3A_33: XP3 (XP3.A33), FPGA_IO (U1.W10)
XP3A_34: XP3 (XP3.A34), FPGA_IO (U1.R17)
XP3A_35: XP3 (XP3.A35), FPGA_IO (U1.V12)
XP3A_36: XP3 (XP3.A36), FPGA_IO (U1.W13)
XP3A_37: XP3 (XP3.A37), FPGA_IO (U1.AB15)
XP3A_38: XP3 (XP3.A38), FPGA_IO (U1.M21)
XP3B_3: XP3 (XP3.B3), FPGA_IO (U1.AB1)
XP3B_4: XP3 (XP3.B4), FPGA_IO (U1.V6)
XP3B_5: XP3 (XP3.B5), FPGA_IO (U1.W5)
XP3B_6: XP3 (XP3.B6), FPGA_IO (U1.AB4)
XP3B_7: XP3 (XP3.B7), FPGA_IO (U1.AB5)
XP3B_8: XP3 (XP3.B8), FPGA_IO (U1.AB7)
XP3B_9: XP3 (XP3.B9), FPGA_IO (U1.AA7)
XP3B_10: XP3 (XP3.B10), FPGA_IO (U1.AB9)
XP3B_11: XP3 (XP3.B11), FPGA_IO (U1.W11)
XP3B_12: XP3 (XP3.B12), FPGA_IO (U1.AA9)
XP3B_13: XP3 (XP3.B13), FPGA_IO (U1.AB6)
XP3B_14: XP3 (XP3.B14), FPGA_IO (U1.AA11)
XP3B_15: XP3 (XP3.B15), FPGA_IO (U1.AB8)
XP3B_16: XP3 (XP3.B16), FPGA_IO (U1.AD11)
XP3B_17: XP3 (XP3.B17), FPGA_IO (U1.V13)
XP3B_18: XP3 (XP3.B18), FPGA_IO (U1.AD9)
XP3B_19: XP3 (XP3.B19), FPGA_IO (U1.AC12)
XP3B_22: XP3 (XP3.B22), FPGA_IO (U1.U12)
XP3B_23: XP3 (XP3.B23), FPGA_IO (U1.U13)
XP3B_24: XP3 (XP3.B24), FPGA_IO (U1.V7)
XP3B_25: XP3 (XP3.B25), FPGA_IO (U1.W14)
XP3B_26: XP3 (XP3.B26), FPGA_IO (U1.V18)
XP3B_27: XP3 (XP3.B27), FPGA_IO (U1.W19)
XP3B_28: XP3 (XP3.B28), FPGA_IO (U1.AB22)
XP3B_29: XP3 (XP3.B29), FPGA_IO (U1.AA23)
XP3B_30: XP3 (XP3.B30), FPGA_IO (U1.AA14)
XP3B_31: XP3 (XP3.B31), FPGA_IO (U1.V22)
XP3B_32: XP3 (XP3.B32), FPGA_IO (U1.Y15)
XP3B_33: XP3 (XP3.B33), FPGA_IO (U1.V11)
XP3B_34: XP3 (XP3.B34), FPGA_IO (U1.V19)
XP3B_35: XP3 (XP3.B35), FPGA_IO (U1.R19)
XP3B_36: XP3 (XP3.B36), FPGA_IO (U1.L20)
XP3B_37: XP3 (XP3.B37), FPGA_IO (U1.AA24)
XP3B_38: XP3 (XP3.B38), FPGA_IO (U1.V23)
XP3C_3: XP3 (XP3.C3), FPGA_IO (U1.AB3)
XP3C_4: XP3 (XP3.C4), FPGA_IO (U1.Y3)
XP3C_5: XP3 (XP3.C5), FPGA_IO (U1.U5)
XP3C_6: XP3 (XP3.C6), FPGA_IO (U1.AA4)
XP3C_7: XP3 (XP3.C7), FPGA_IO (U1.AC3)
XP3C_8: XP3 (XP3.C8), FPGA_IO (U1.AC5)
XP3C_9: XP3 (XP3.C9), FPGA_IO (U1.AC2)
XP3C_10: XP3 (XP3.C10), FPGA_IO (U1.AD3)
XP3C_11: XP3 (XP3.C11), FPGA_IO (U1.AD4)
XP3C_12: XP3 (XP3.C12), FPGA_IO (U1.AB10)
XP3C_13: XP3 (XP3.C13), FPGA_IO (U1.AC7)
XP3C_14: XP3 (XP3.C14), FPGA_IO (U1.AD6)
XP3C_15: XP3 (XP3.C15), FPGA_IO (U1.AD7)
XP3C_16: XP3 (XP3.C16), FPGA_IO (U1.AD8)
XP3C_19: XP3 (XP3.C19), FPGA_IO (U1.AD12)
XP3C_22: XP3 (XP3.C22), FPGA_IO (U1.U7)
XP3C_25: XP3 (XP3.C25), FPGA_IO (U1.J17)
XP3C_26: XP3 (XP3.C26), FPGA_IO (U1.V14)
XP3C_27: XP3 (XP3.C27), FPGA_IO (U1.AA15)
XP3C_28: XP3 (XP3.C28), FPGA_IO (U1.AA12)
XP3C_29: XP3 (XP3.C29), FPGA_IO (U1.Y22)
XP3C_30: XP3 (XP3.C30), FPGA_IO (U1.R18)
XP3C_31: XP3 (XP3.C31), FPGA_IO (U1.W18)
XP3C_32: XP3 (XP3.C32), FPGA_IO (U1.AB21)
XP3C_33: XP3 (XP3.C33), FPGA_IO (U1.U21)
XP3C_34: XP3 (XP3.C34), FPGA_IO (U1.V17)
XP3C_35: XP3 (XP3.C35), FPGA_IO (U1.U22)
XP3C_36: XP3 (XP3.C36), FPGA_IO (U1.AC24)
XP3C_37: XP3 (XP3.C37), FPGA_IO (U1.AB24)
XP3C_38: XP3 (XP3.C38), FPGA_IO (U1.W24)
XP3D_3: XP3 (XP3.D3), FPGA_IO (U1.AC1)
XP3D_4: XP3 (XP3.D4), FPGA_IO (U1.AD1)
XP3D_5: XP3 (XP3.D5), FPGA_IO (U1.AE1)
XP3D_6: XP3 (XP3.D6), FPGA_IO (U1.AE2)
XP3D_7: XP3 (XP3.D7), FPGA_IO (U1.AF2)
XP3D_8: XP3 (XP3.D8), FPGA_IO (U1.AE5)
XP3D_9: XP3 (XP3.D9), FPGA_IO (U1.AC4)
XP3D_10: XP3 (XP3.D10), FPGA_IO (U1.AE3)
XP3D_11: XP3 (XP3.D11), FPGA_IO (U1.AF5)
XP3D_12: XP3 (XP3.D12), FPGA_IO (U1.AF6)
XP3D_13: XP3 (XP3.D13), FPGA_IO (U1.AF8)
XP3D_14: XP3 (XP3.D14), FPGA_IO (U1.AE11)
XP3D_15: XP3 (XP3.D15), FPGA_IO (U1.AF11)
XP3D_16: XP3 (XP3.D16), FPGA_IO (U1.AF12)
XP3D_19: XP3 (XP3.D19), FPGA_IO (U1.AD13)
XP3D_25: XP3 (XP3.D25), FPGA_IO (U1.U15)
XP3D_26: XP3 (XP3.D26), FPGA_IO (U1.AF16)
XP3D_27: XP3 (XP3.D27), FPGA_IO (U1.V20)
XP3D_28: XP3 (XP3.D28), FPGA_IO (U1.AC23)
XP3D_29: XP3 (XP3.D29), FPGA_IO (U1.Y20)
XP3D_30: XP3 (XP3.D30), FPGA_IO (U1.AE24)
XP3D_31: XP3 (XP3.D31), FPGA_IO (U1.AF25)
XP3D_32: XP3 (XP3.D32), FPGA_IO (U1.T19)
XP3D_33: XP3 (XP3.D33), FPGA_IO (U1.AE25)
XP3D_34: XP3 (XP3.D34), FPGA_IO (U1.AE26)
XP3D_35: XP3 (XP3.D35), FPGA_IO (U1.AD26)
XP3D_36: XP3 (XP3.D36), FPGA_IO (U1.AC25)
XP3D_37: XP3 (XP3.D37), FPGA_IO (U1.AC26)
XP3D_38: XP3 (XP3.D38), FPGA_IO (U1.AB26)
XP4A_3: XP4 (XP4.A3), FPGA_IO (U1.H16)
XP4A_4: XP4 (XP4.A4), FPGA_IO (U1.J20)
XP4A_5: XP4 (XP4.A5), FPGA_IO (U1.B26)
XP4A_6: XP4 (XP4.A6), FPGA_IO (U1.C26)
XP4A_7: XP4 (XP4.A7), FPGA_IO (U1.D26)
XP4A_8: XP4 (XP4.A8), FPGA_IO (U1.E26)
XP4A_9: XP4 (XP4.A9), FPGA_IO (U1.F26)
XP4A_29: XP4 (XP4.A29), FPGA_IO (U1.K26)
XP4A_30: XP4 (XP4.A30), FPGA_IO (U1.L26)
XP4A_31: XP4 (XP4.A31), FPGA_IO (U1.M26)
XP4A_32: XP4 (XP4.A32), FPGA_IO (U1.N25)
XP4A_33: XP4 (XP4.A33), FPGA_IO (U1.N26)
XP4A_34: XP4 (XP4.A34), FPGA_IO (U1.U26)
XP4A_35: XP4 (XP4.A35), FPGA_IO (U1.U25)
XP4A_36: XP4 (XP4.A36), FPGA_IO (U1.Y26)
XP4A_37: XP4 (XP4.A37), FPGA_IO (U1.AA26)
XP4A_38: XP4 (XP4.A38), FPGA_IO (U1.AA25)
XP4B_3: XP4 (XP4.B3), FPGA_IO (U1.J24)
XP4B_4: XP4 (XP4.B4), FPGA_IO (U1.K19)
XP4B_5: XP4 (XP4.B5), FPGA_IO (U1.C25)
XP4B_6: XP4 (XP4.B6), FPGA_IO (U1.C24)
XP4B_7: XP4 (XP4.B7), FPGA_IO (U1.E25)
XP4B_8: XP4 (XP4.B8), FPGA_IO (U1.F24)
XP4B_29: XP4 (XP4.B29), FPGA_IO (U1.N20)
XP4B_30: XP4 (XP4.B30), FPGA_IO (U1.P21)
XP4B_31: XP4 (XP4.B31), FPGA_IO (U1.P22)
XP4B_32: XP4 (XP4.B32), FPGA_IO (U1.R22)
XP4B_33: XP4 (XP4.B33), FPGA_IO (U1.R24)
XP4B_34: XP4 (XP4.B34), FPGA_IO (U1.R20)
XP4B_35: XP4 (XP4.B35), FPGA_IO (U1.T22)
XP4B_36: XP4 (XP4.B36), FPGA_IO (U1.U24)
XP4B_37: XP4 (XP4.B37), FPGA_IO (U1.T18)
XP4B_38: XP4 (XP4.B38), FPGA_IO (U1.T23)
XP4C_3: XP4 (XP4.C3), FPGA_IO (U1.D22)
XP4C_4: XP4 (XP4.C4), FPGA_IO (U1.E23)
XP4C_5: XP4 (XP4.C5), FPGA_IO (U1.G20)
XP4C_6: XP4 (XP4.C6), FPGA_IO (U1.G21)
XP4C_7: XP4 (XP4.C7), FPGA_IO (U1.E24)
XP4C_8: XP4 (XP4.C8), FPGA_IO (U1.H24)
XP4C_29: XP4 (XP4.C29), FPGA_IO (U1.H26)
XP4C_30: XP4 (XP4.C30), FPGA_IO (U1.J26)
XP4C_31: XP4 (XP4.C31), FPGA_IO (U1.P10)
XP4C_32: XP4 (XP4.C32), FPGA_IO (U1.J23)
XP4C_33: XP4 (XP4.C33), FPGA_IO (U1.R23)
XP4C_34: XP4 (XP4.C34), FPGA_IO (U1.H21)
XP4C_35: XP4 (XP4.C35), FPGA_IO (U1.H20)
XP4C_36: XP4 (XP4.C36), FPGA_IO (U1.L21)
XP4C_37: XP4 (XP4.C37), FPGA_IO (U1.R21)
XP4C_38: XP4 (XP4.C38), FPGA_IO (U1.AD24)
XP4D_3: XP4 (XP4.D3), FPGA_IO (U1.G23)
XP4D_4: XP4 (XP4.D4), FPGA_IO (U1.D24)
XP4D_5: XP4 (XP4.D5), FPGA_IO (U1.F22)
XP4D_6: XP4 (XP4.D6), FPGA_IO (U1.G22)
XP4D_7: XP4 (XP4.D7), FPGA_IO (U1.G24)
XP4D_8: XP4 (XP4.D8), FPGA_IO (U1.J25)
XP4D_22: XP4 (XP4.D22), FPGA_IO (U1.G26)
XP4D_23: XP4 (XP4.D23), FPGA_IO (U1.G25)
XP4D_29: XP4 (XP4.D29), FPGA_IO (U1.L19)
XP4D_30: XP4 (XP4.D30), FPGA_IO (U1.N9)
XP4D_31: XP4 (XP4.D31), FPGA_IO (U1.H22)
XP4D_32: XP4 (XP4.D32), FPGA_IO (U1.H19)
XP4D_33: XP4 (XP4.D33), FPGA_IO (U1.G19)
XP4D_34: XP4 (XP4.D34), FPGA_IO (U1.K24)
XP4D_35: XP4 (XP4.D35), FPGA_IO (U1.K20)
XP4D_36: XP4 (XP4.D36), FPGA_IO (U1.J22)
XP4D_37: XP4 (XP4.D37), FPGA_IO (U1.K22)
XP4D_38: XP4 (XP4.D38), FPGA_IO (U1.T20)